# Altium schematic sheet STM32G474R.SchDoc
size B; SheetNumber: 5; SheetTotal: 5
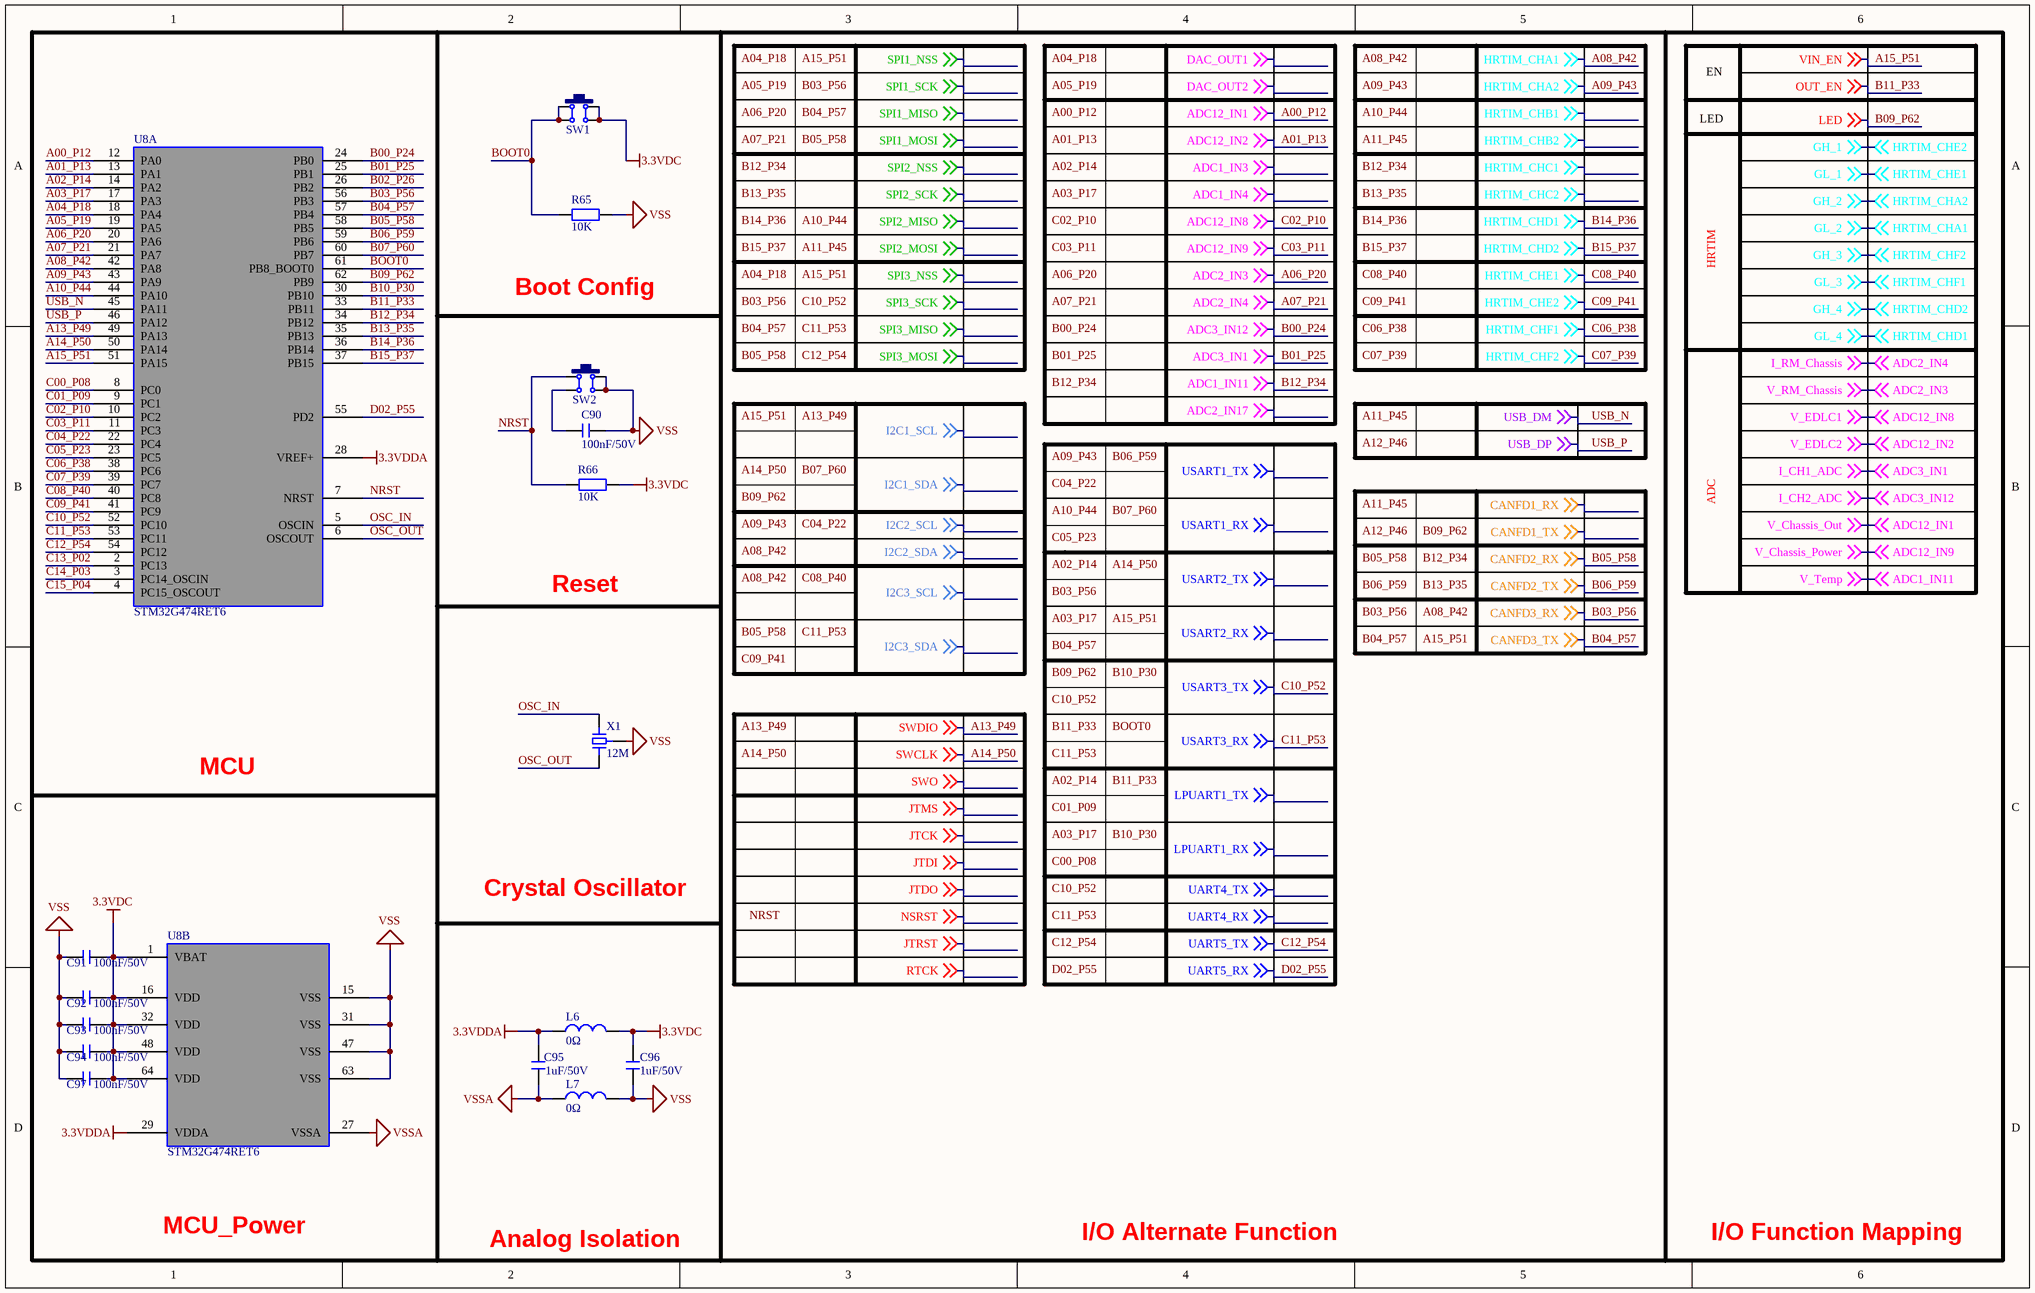
[diagram p0: STM32G474R.SchDoc]

## Parts
C90  100nF/50V  [C 0603_L]
C91  100nF/50V  [C 0603_L]
C92  100nF/50V  [C 0603_L]
C93  100nF/50V  [C 0603_L]
C94  100nF/50V  [C 0603_L]
C95  1uF/50V  [C 0603_L]
C96  1uF/50V  [C 0603_L]
C97  100nF/50V  [C 0603_L]
L6  0Ω  [L 0603]
L7  0Ω  [L 0603]
R65  10K  [R 0603_L]
R66  10K  [R 0603_L]
SW1  3.2x4.2x2.5  [TSW SMD-3.2*4.2*2.5]  (value not drawn)
SW2  3.2x4.2x2.5  [TSW SMD-3.2*4.2*2.5]  (value not drawn)
U8  STM32G474RET6  [LQFP64-10*10]  (parts A,B of 2)
X1  12M  [OSC 3213-3P]

## Nets
3.3VDC: C91.2 C92.2 C93.2 C94.2 C96.2 C97.2 L6.2 R66.1 SW1.1 SW1.4 U8.1(VBAT) U8.16(VDD) U8.32(VDD) U8.48(VDD) U8.64(VDD)
3.3VDDA: C95.2 L6.1 U8.28(VREF+) U8.29(VDDA)
VSS: C90.2 C91.1 C92.1 C93.1 C94.1 C96.1 C97.1 L7.2 R65.1 SW2.1 SW2.4 U8.15(VSS) U8.31(VSS) U8.47(VSS) U8.63(VSS) X1.3
VSSA: C95.1 L7.1 U8.27(VSSA)
A00_P12: U8.12(PA0) ; off-sheet ADC12_IN1, off-sheet V_Chassis_Out  [also labelled ADC12_IN1, V_Chassis_Out]
A01_P13: U8.13(PA1) ; off-sheet ADC12_IN2, off-sheet V_EDLC2  [also labelled ADC12_IN2, V_EDLC2]
A02_P14: U8.14(PA2)
A03_P17: U8.17(PA3)
A04_P18: U8.18(PA4)
A05_P19: U8.19(PA5)
A06_P20: U8.20(PA6) ; off-sheet ADC2_IN3, off-sheet V_RM_Chassis  [also labelled ADC2_IN3, V_RM_Chassis]
A07_P21: U8.21(PA7) ; off-sheet ADC2_IN4, off-sheet I_RM_Chassis  [also labelled ADC2_IN4, I_RM_Chassis]
A08_P42: U8.42(PA8) ; off-sheet HRTIM_CHA1, off-sheet GL_2  [also labelled GL_2, HRTIM_CHA1]
A09_P43: U8.43(PA9) ; off-sheet HRTIM_CHA2, off-sheet GH_2  [also labelled GH_2, HRTIM_CHA2]
A10_P44: U8.44(PA10)
A13_P49: U8.49(PA13) ; off-sheet SWDIO  [also labelled SWDIO]
A14_P50: U8.50(PA14) ; off-sheet SWCLK  [also labelled SWCLK]
A15_P51: U8.51(PA15) ; off-sheet VIN_EN  [also labelled VIN_EN]
B00_P24: U8.24(PB0) ; off-sheet ADC3_IN12, off-sheet I_CH2_ADC  [also labelled ADC3_IN12, I_CH2_ADC]
B01_P25: U8.25(PB1) ; off-sheet ADC3_IN1, off-sheet I_CH1_ADC  [also labelled ADC3_IN1, I_CH1_ADC]
B02_P26: U8.26(PB2)
B03_P56: U8.56(PB3) ; off-sheet CANFD3_RX  [also labelled CANFD3_RX]
B04_P57: U8.57(PB4) ; off-sheet CANFD3_TX  [also labelled CANFD3_TX]
B05_P58: U8.58(PB5) ; off-sheet CANFD2_RX  [also labelled CANFD2_RX]
B06_P59: U8.59(PB6) ; off-sheet CANFD2_TX  [also labelled CANFD2_TX]
B07_P60: U8.60(PB7)
B09_P62: U8.62(PB9) ; off-sheet LED  [also labelled LED]
B10_P30: U8.30(PB10)
B11_P33: U8.33(PB11) ; off-sheet OUT_EN  [also labelled OUT_EN]
B12_P34: U8.34(PB12) ; off-sheet ADC1_IN11, off-sheet V_Temp  [also labelled ADC1_IN11, V_Temp]
B13_P35: U8.35(PB13)
B14_P36: U8.36(PB14) ; off-sheet HRTIM_CHD1, off-sheet GL_4  [also labelled GL_4, HRTIM_CHD1]
B15_P37: U8.37(PB15) ; off-sheet HRTIM_CHD2, off-sheet GH_4  [also labelled GH_4, HRTIM_CHD2]
BOOT0: R65.2 SW1.2 SW1.3 U8.61(PB8_BOOT0)
C00_P08: U8.8(PC0)
C01_P09: U8.9(PC1)
C02_P10: U8.10(PC2) ; off-sheet ADC12_IN8, off-sheet V_EDLC1  [also labelled ADC12_IN8, V_EDLC1]
C03_P11: U8.11(PC3) ; off-sheet ADC12_IN9, off-sheet V_Chassis_Power  [also labelled ADC12_IN9, V_Chassis_Power]
C04_P22: U8.22(PC4)
C05_P23: U8.23(PC5)
C06_P38: U8.38(PC6) ; off-sheet HRTIM_CHF1, off-sheet GL_3  [also labelled GL_3, HRTIM_CHF1]
C07_P39: U8.39(PC7) ; off-sheet HRTIM_CHF2, off-sheet GH_3  [also labelled GH_3, HRTIM_CHF2]
C08_P40: U8.40(PC8) ; off-sheet HRTIM_CHE1, off-sheet GL_1  [also labelled GL_1, HRTIM_CHE1]
C09_P41: U8.41(PC9) ; off-sheet HRTIM_CHE2, off-sheet GH_1  [also labelled GH_1, HRTIM_CHE2]
C10_P52: U8.52(PC10) ; off-sheet USART3_TX  [also labelled USART3_TX]
C11_P53: U8.53(PC11) ; off-sheet USART3_RX  [also labelled USART3_RX]
C12_P54: U8.54(PC12) ; off-sheet UART5_TX  [also labelled UART5_TX]
C13_P02: U8.2(PC13)
C14_P03: U8.3(PC14_OSCIN)
C15_P04: U8.4(PC15_OSCOUT)
D02_P55: U8.55(PD2) ; off-sheet UART5_RX  [also labelled UART5_RX]
NRST: R66.2 SW2.2 U8.7(NRST)
OSC_IN: U8.5(OSCIN) X1.2
OSC_OUT: U8.6(OSCOUT) X1.1
USB_N: U8.45(PA11) ; off-sheet USB_DM  [also labelled USB_DM]
USB_P: U8.46(PA12) ; off-sheet USB_DP  [also labelled USB_DP]
NetC90_1: C90.1 SW2.3

## Notes on the sheet
- EN
- LED
- Boot Config
- HRTIM
- ADC
- Reset
- MCU
- Crystal Oscillator
- MCU_Power
- I/O Alternate Function
- I/O Function Mapping
- Analog Isolation
- Labels drawn without touching a wire or pin: A00_P12, A01_P13, A02_P14, A03_P17, A04_P18, A05_P19, A06_P20, A07_P21, A08_P42, A09_P43, A10_P44, A11_P45, A12_P46, A13_P49, A14_P50, A15_P51, B00_P24, B01_P25, B03_P56, B04_P57, B05_P58, B06_P59, B07_P60, B09_P62, B10_P30, B11_P33, B12_P34, B13_P35, B14_P36, B15_P37, BOOT0, C00_P08, C01_P09, C02_P10, C03_P11, C04_P22, C05_P23, C06_P38, C07_P39, C08_P40, C09_P41, C10_P52, C11_P53, C12_P54, D02_P55, NRST

## Library data of the parts
C90-C97 = C: 无极性贴片电容; 版权归属: 源创客; BOM名称: 无极性贴片电容; 学习资源: www.ooocke.com
L6 L7 = L: 小功率贴片电感; 版权归属: 源创客; BOM名称: 小功率贴片电感; 学习资源: www.ooocke.com
R65 R66 = R: 贴片电阻; 版权归属: 源创客; BOM名称: 贴片电阻; 学习资源: www.ooocke.com
SW1 SW2 = TSW SMD-3x4_D: 3.2x4.2轻触开关; BOM名称: 3x6轻触开关; 版权归属: 源创客; 学习资源: www.ooocke.com
X1 = XTAL-3P: 3脚内置电容无源晶振